# EAGLE schematic io_board (EAGLE 7.7.0)
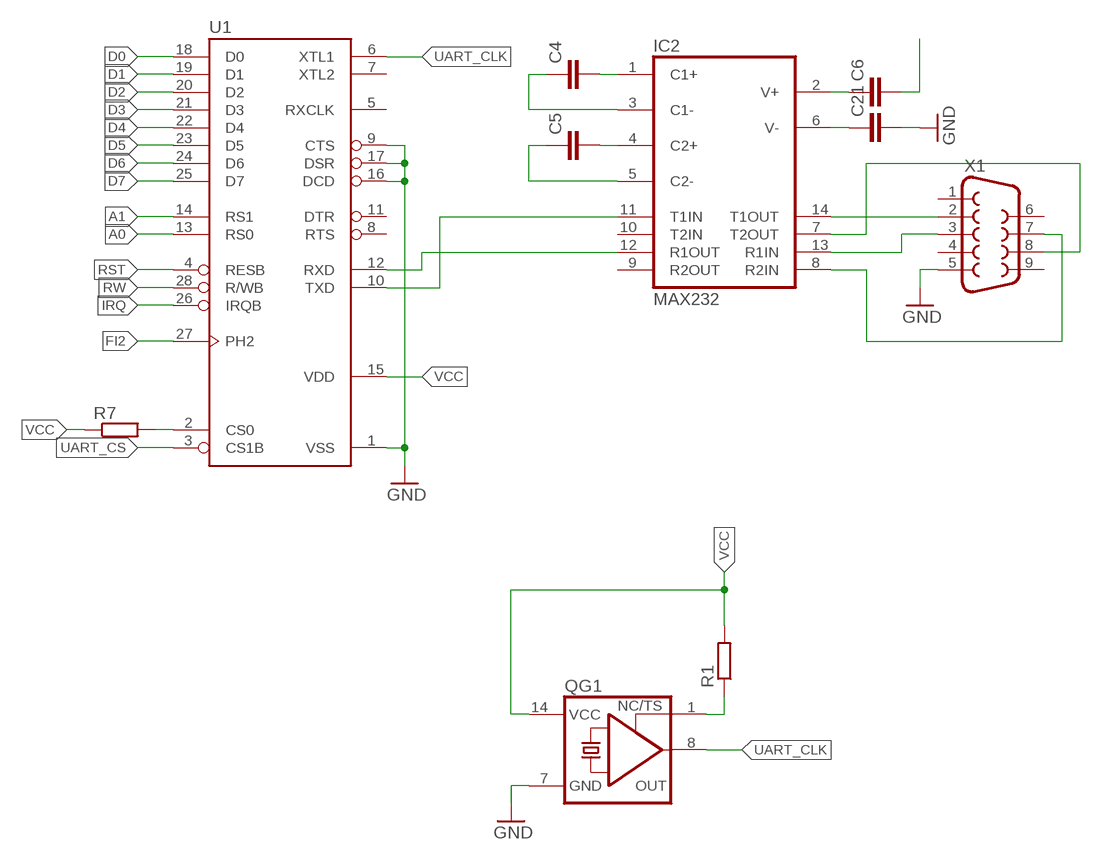
[diagram p0: schematic, sheet 1, part 1 of 2]
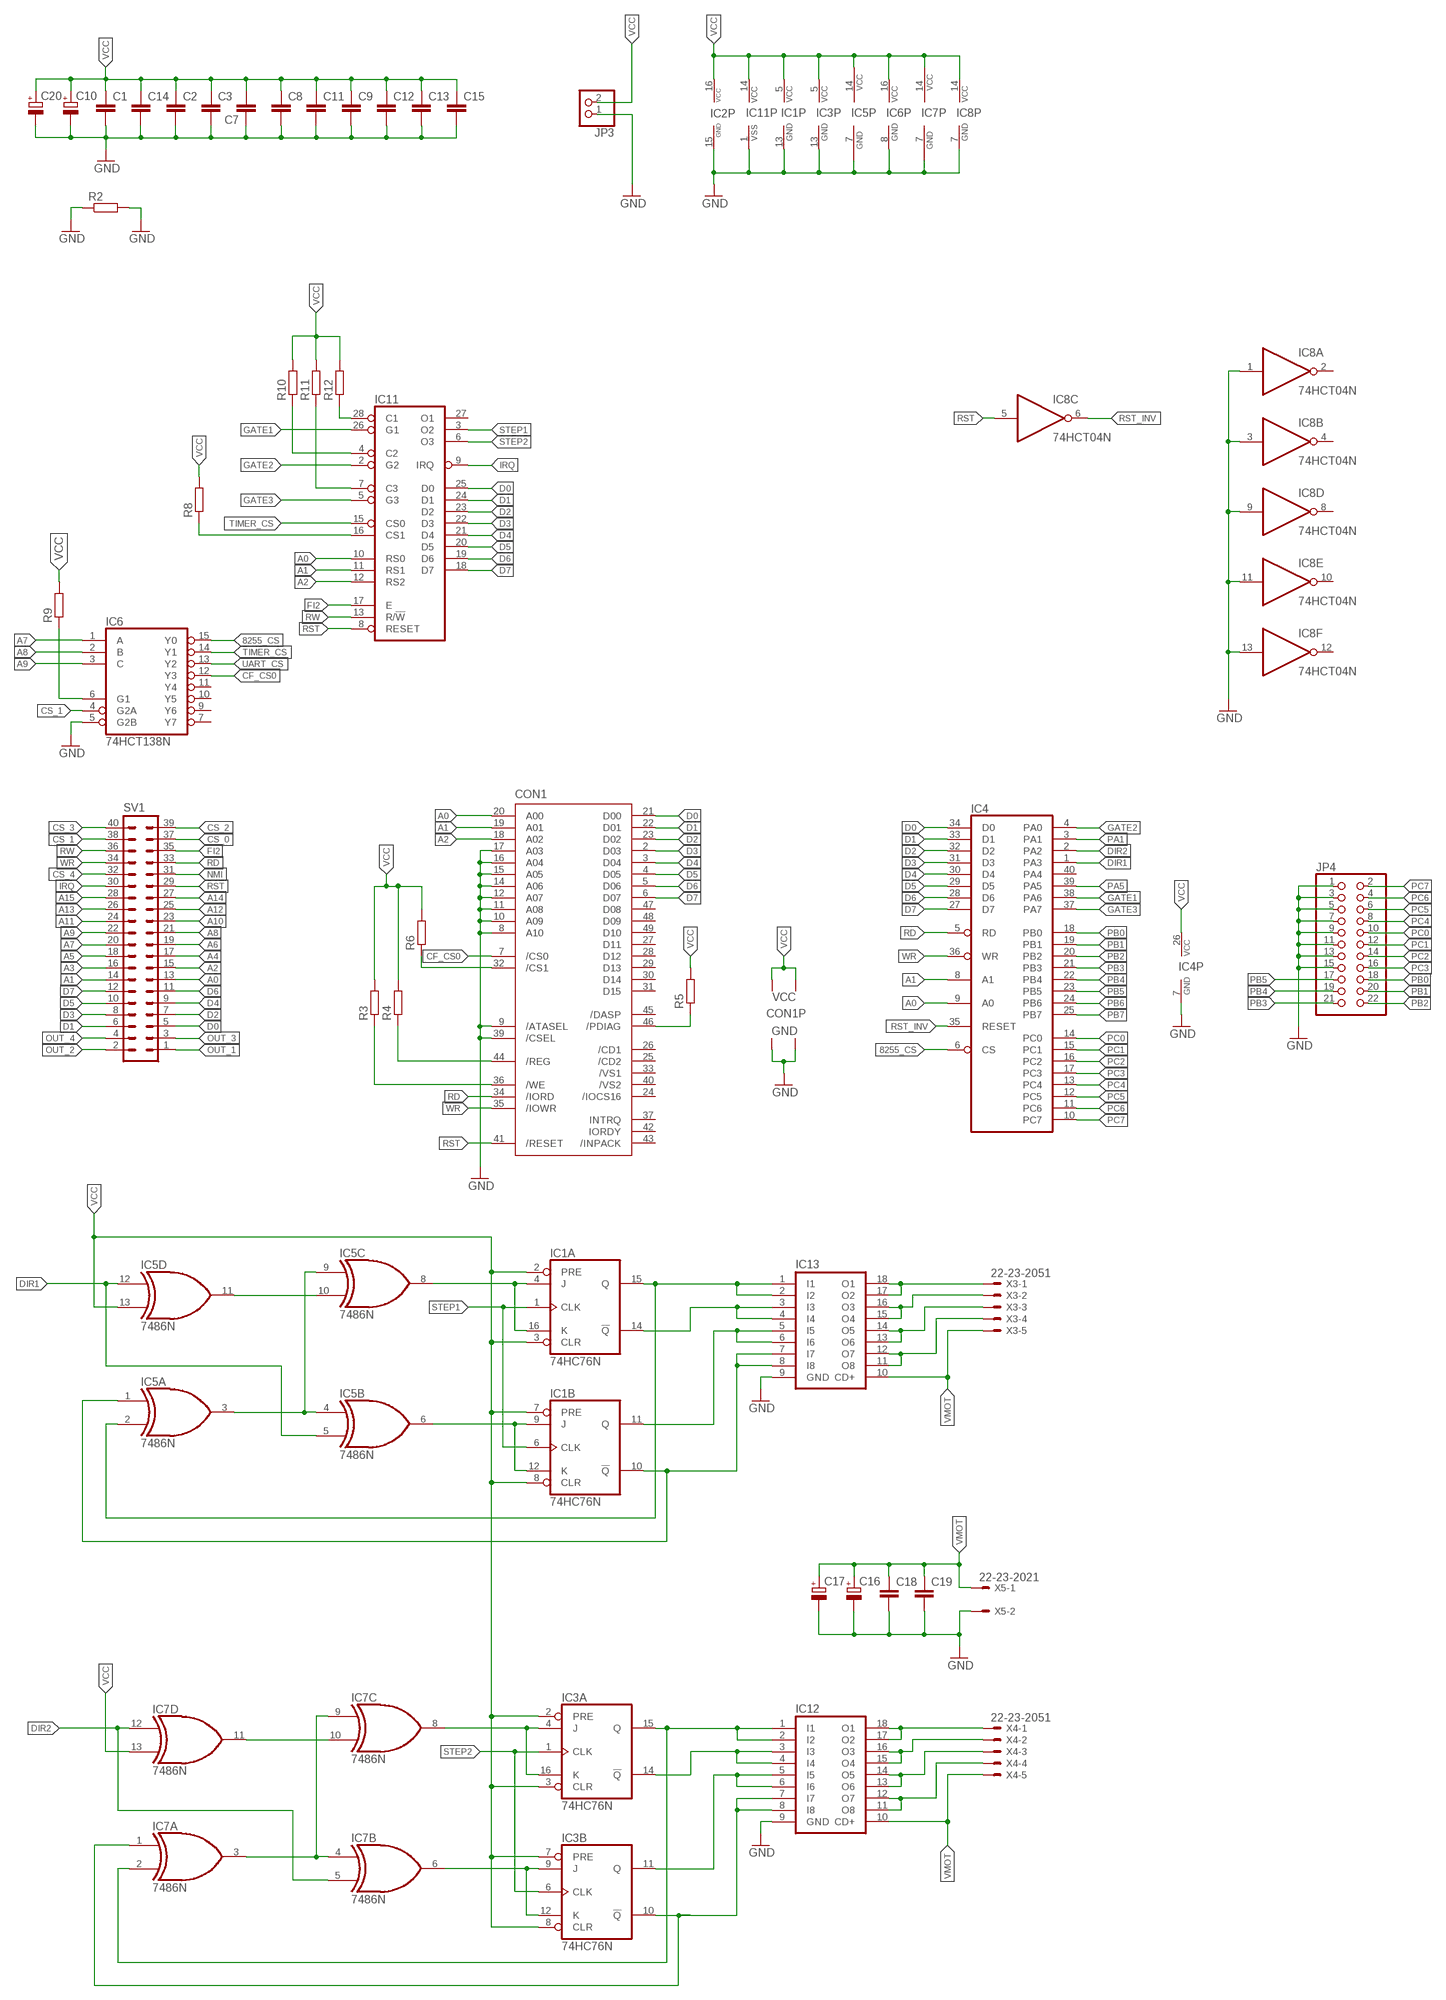
[diagram p1: schematic, sheet 1, part 2 of 2]

## Parts
C1  C-EUC1206  [C1206]
C2  C-EUC1206  [C1206]
C3  C-EUC1206  [C1206]
C4  C-EUC0603  [C0603]
C5  C-EUC0603  [C0603]
C6  C-EUC0603  [C0603]
C7  C-EUC0603  [C0603]
C8  C-EUC0603  [C0603]
C9  C-EUC0603  [C0603]
C10  CPOL-EUE5-10.5  [E5-10,5]
C11  C-EU050-024X044  [C050-024X044]
C12  C-EUC0603  [C0603]
C13  C-EUC0603  [C0603]
C14  C-EUC1206  [C1206]
C15  C-EUC0603  [C0603]
C16  CPOL-EUE5-6  [E5-6]
C17  CPOL-EUE5-6  [E5-6]
C18  C-EUC0603  [C0603]
C19  C-EUC0603  [C0603]
C20  CPOL-EUSMCB  [SMC_B]
C21  C-EUC0603  [C0603]
CON1  CF-CARD-IDE_MODE  [MI20-50PD-SF]
IC1  74HC76N  [DIL16]
IC2  MAX232  [DIL16]
IC3  74HC76N  [DIL16]
IC4  8255A  [DIL40]
IC5  7486N  [DIL14]
IC6  74HCT138N  [DIL16]
IC7  7486N  [DIL14]
IC8  74HCT04N  [DIL14]
IC11  6840  [DIL28]
IC12  ULN2803A  [DIL18]
IC13  ULN2803A  [DIL18]
JP3  PINHD-1X2/90  [1X02/90]
JP4  PINHD-2X11  [2X11]
QG1  XO-14  [DIL14S]
R1  R-EU_R1206  [R1206]
R2  R-EU_M1206  [M1206]
R3  R-EU_R0603  [R0603]
R4  R-EU_R0603  [R0603]
R5  R-EU_R0603  [R0603]
R6  R-EU_R0603  [R0603]
R7  R-EU_R0603  [R0603]
R8  R-EU_R0402  [R0402]
R9  R-EU_R1206  [R1206]
R10  R-EU_R0603  [R0603]
R11  R-EU_0204/7  [0204/7]
R12  R-EU_0204/5  [0204/5]
SV1  ML40L  [ML40L]
U1  G65SC51P  [DIP-28]
X1  F09HP  [F09HP]
X3  22-23-2051  [22-23-2051]
X4  22-23-2051  [22-23-2051]
X5  22-23-2021  [22-23-2021]

## Nets
8255_CS: IC4.6(CS) IC6.15(Y0)
A0: CON1.20(A00) IC4.9(A0) IC11.10(RS0) SV1.13 U1.13(RS0)
A1: CON1.19(A01) IC4.8(A1) IC11.11(RS1) SV1.14 U1.14(RS1)
A2: CON1.18(A02) IC11.12(RS2) SV1.15
A3: SV1.16
A4: SV1.17
A5: SV1.18
A6: SV1.19
A7: IC6.1(A) SV1.20
A8: IC6.2(B) SV1.21
A9: IC6.3(C) SV1.22
A10: SV1.23
A11: SV1.24
A12: SV1.25
A13: SV1.26
A14: SV1.27
A15: SV1.28
CF_CS0: CON1.7(/CS0) IC6.12(Y3)
CS_0: SV1.37
CS_1: IC6.4(G2A) SV1.38
CS_2: SV1.39
CS_3: SV1.40
CS_4: SV1.32
D0: CON1.21(D00) IC4.34(D0) IC11.25(D0) SV1.5 U1.18(D0)
D1: CON1.22(D01) IC4.33(D1) IC11.24(D1) SV1.6 U1.19(D1)
D2: CON1.23(D02) IC4.32(D2) IC11.23(D2) SV1.7 U1.20(D2)
D3: CON1.2(D03) IC4.31(D3) IC11.22(D3) SV1.8 U1.21(D3)
D4: CON1.3(D04) IC4.30(D4) IC11.21(D4) SV1.9 U1.22(D4)
D5: CON1.4(D05) IC4.29(D5) IC11.20(D5) SV1.10 U1.23(D5)
D6: CON1.5(D06) IC4.28(D6) IC11.19(D6) SV1.11 U1.24(D6)
D7: CON1.6(D07) IC4.27(D7) IC11.18(D7) SV1.12 U1.25(D7)
DIR1: IC4.1(PA3) IC5.5(B:I1) IC5.12(D:I0)
DIR2: IC4.2(PA2) IC7.5(B:I1) IC7.12(D:I0)
FI2: IC11.17(E) SV1.35 U1.27(PH2)
GATE1: IC4.38(PA6) IC11.26(G1)
GATE2: IC4.4(PA0) IC11.2(G2)
GATE3: IC4.37(PA7) IC11.5(G3)
GND: C1.2 C2.2 C3.2 C7.1 C8.2 C9.2 C10.- C11.2 C12.2 C13.2 C14.2 C15.2 C16.- C17.- C18.2 C19.2 C20.- C21.2 CON1.1(GND1) CON1.8(A10) CON1.9(/ATASEL) CON1.10(A09) CON1.11(A08) CON1.12(A07) CON1.14(A06) CON1.15(A05) CON1.16(A04) CON1.17(A03) CON1.39(/CSEL) CON1.50(GND2) IC1.13(P:GND) IC2.15(GND) IC3.13(P:GND) IC4.7(GND) IC5.7(P:GND) IC6.5(G2B) IC6.8(GND) IC7.7(P:GND) IC8.1(A:I) IC8.3(B:I) IC8.7(P:GND) IC8.9(D:I) IC8.11(E:I) IC8.13(F:I) IC11.1(VSS) IC12.9(GND) IC13.9(GND) JP3.1 JP4.1 JP4.3 JP4.5 JP4.7 JP4.9 JP4.11 JP4.13 JP4.15 QG1.7(GND) R2.1 R2.2 U1.1(VSS) U1.9(CTS) U1.16(DCD) U1.17(DSR) X1.5 X5.2
IRQ: IC11.9(IRQ) SV1.30 U1.26(IRQB)
MOT1_PHASE1: IC1.15(A:Q) IC5.2(A:I1) IC13.1(I1) IC13.2(I2)
MOT1_PHASE2: IC1.14(A:!Q) IC13.3(I3) IC13.4(I4)
MOT1_PHASE3: IC1.11(B:Q) IC13.5(I5) IC13.6(I6)
MOT1_PHASE4: IC1.10(B:!Q) IC5.1(A:I0) IC13.7(I7) IC13.8(I8)
MOT1_PHASE5: IC3.15(A:Q) IC7.2(A:I1) IC12.1(I1) IC12.2(I2)
MOT1_PHASE6: IC3.14(A:!Q) IC12.3(I3) IC12.4(I4)
MOT1_PHASE7: IC3.11(B:Q) IC12.5(I5) IC12.6(I6)
MOT1_PHASE8: IC3.10(B:!Q) IC7.1(A:I0) IC12.7(I7) IC12.8(I8)
N$5: QG1.1(TS) R1.1
N$6: IC2.13(R1IN) X1.3
N$7: IC2.7(T2OUT) X1.8
N$8: IC2.8(R2IN) X1.7
N$9: C4.2 IC2.1(C1+)
N$10: C5.2 IC2.4(C2+)
N$11: C5.1 IC2.5(C2-)
N$12: C4.1 IC2.3(C1-)
N$13: C6.1 IC2.2(V+)
N$14: C21.1 IC2.6(V-)
N$15: CON1.32(/CS1) R6.1
N$16: IC2.14(T1OUT) X1.2
N$17: R7.2 U1.2(CS0)
N$18: IC6.6(G1) R9.1
N$19: CON1.44(/REG) R4.1
N$20: CON1.36(/WE) R3.1
N$21: CON1.46(/PDIAG) R5.1
N$22: IC1.4(A:J) IC1.16(A:K) IC5.8(C:O)
N$26: IC5.10(C:I1) IC5.11(D:O)
N$27: IC5.3(A:O) IC5.4(B:I0) IC5.9(C:I0)
N$28: IC1.9(B:J) IC1.12(B:K) IC5.6(B:O)
N$29: IC13.17(O2) IC13.18(O1) X3.1
N$30: IC13.15(O4) IC13.16(O3) X3.2
N$31: IC13.13(O6) IC13.14(O5) X3.3
N$32: IC13.11(O8) IC13.12(O7) X3.4
N$33: IC7.10(C:I1) IC7.11(D:O)
N$34: IC7.3(A:O) IC7.4(B:I0) IC7.9(C:I0)
N$35: IC3.4(A:J) IC3.16(A:K) IC7.8(C:O)
N$36: IC3.9(B:J) IC3.12(B:K) IC7.6(B:O)
N$38: IC12.17(O2) IC12.18(O1) X4.1
N$39: IC12.15(O4) IC12.16(O3) X4.2
N$40: IC12.13(O6) IC12.14(O5) X4.3
N$41: IC12.11(O8) IC12.12(O7) X4.4
N$42: IC11.16(CS1) R8.1
N$252: IC11.4(C2) R10.1
N$253: IC11.7(C3) R11.1
N$255: IC11.28(C1) R12.1
NMI: SV1.31
OUT_1: SV1.1
OUT_2: SV1.2
OUT_3: SV1.3
OUT_4: SV1.4
PA1: IC4.3(PA1)
PA5: IC4.39(PA5)
PB0: IC4.18(PB0) JP4.18
PB1: IC4.19(PB1) JP4.20
PB2: IC4.20(PB2) JP4.22
PB3: IC4.21(PB3) JP4.21
PB4: IC4.22(PB4) JP4.19
PB5: IC4.23(PB5) JP4.17
PB6: IC4.24(PB6)
PB7: IC4.25(PB7)
PC0: IC4.14(PC0) JP4.10
PC1: IC4.15(PC1) JP4.12
PC2: IC4.16(PC2) JP4.14
PC3: IC4.17(PC3) JP4.16
PC4: IC4.13(PC4) JP4.8
PC5: IC4.12(PC5) JP4.6
PC6: IC4.11(PC6) JP4.4
PC7: IC4.10(PC7) JP4.2
RD: CON1.34(/IORD) IC4.5(RD) SV1.33
RST: CON1.41(/RESET) IC8.5(C:I) IC11.8(RESET) SV1.29 U1.4(RESB)
RST_INV: IC4.35(RESET) IC8.6(C:O)
RW: IC11.13(R/!W) SV1.36 U1.28(R/WB)
RXD_TTL: IC2.12(R1OUT) U1.12(RXD)
STEP1: IC1.1(A:CLK) IC1.6(B:CLK) IC11.3(O2)
STEP2: IC3.1(A:CLK) IC3.6(B:CLK) IC11.6(O3)
TIMER_CS: IC6.14(Y1) IC11.15(CS0)
TXD_TTL: IC2.11(T1IN) U1.10(TXD)
UART_CLK: QG1.8(OUT) U1.6(XTL1)
UART_CS: IC6.13(Y2) U1.3(CS1B)
VCC: C1.1 C2.1 C3.1 C6.2 C7.2 C8.1 C9.1 C10.+ C11.1 C12.1 C13.1 C14.1 C15.1 C20.+ CON1.13(VCC2) CON1.38(VCC1) IC1.2(A:PRE) IC1.3(A:CLR) IC1.5(P:VCC) IC1.7(B:PRE) IC1.8(B:CLR) IC2.16(VCC) IC3.2(A:PRE) IC3.3(A:CLR) IC3.5(P:VCC) IC3.7(B:PRE) IC3.8(B:CLR) IC4.26(VCC) IC5.13(D:I1) IC5.14(P:VCC) IC6.16(VCC) IC7.13(D:I1) IC7.14(P:VCC) IC8.14(P:VCC) IC11.14(VCC) JP3.2 QG1.14(VCC) R1.2 R3.2 R4.2 R5.2 R6.2 R7.1 R8.2 R9.2 R10.2 R11.2 R12.2 U1.15(VDD)
VMOT: C16.+ C17.+ C18.1 C19.1 IC12.10(CD+) IC13.10(CD+) X3.5 X4.5 X5.1
WR: CON1.35(/IOWR) IC4.36(WR) SV1.34
Unconnected: CON1.24(/IOCS16) CON1.25(/CD2) CON1.26(/CD1) CON1.27(D11) CON1.28(D12) CON1.29(D13) CON1.30(D14) CON1.31(D15) CON1.33(/VS1) CON1.37(INTRQ) CON1.40(/VS2) CON1.42(IORDY) CON1.43(/INPACK) CON1.45(/DASP) CON1.47(D08) CON1.48(D09) CON1.49(D10) IC2.9(R2OUT) IC2.10(T2IN) IC4.40(PA4) IC6.7(Y7) IC6.9(Y6) IC6.10(Y5) IC6.11(Y4) IC8.2(A:O) IC8.4(B:O) IC8.8(D:O) IC8.10(E:O) IC8.12(F:O) IC11.27(O1) U1.5(RXCLK) U1.7(XTL2) U1.8(RTS) U1.11(DTR) X1.1 X1.4 X1.6 X1.9

## Library data of the parts
C1-C9 C11-C15 C18 C19 C21 = rcl:C-EU: CAPACITOR, European symbol
C10 C16 C17 C20 = rcl:CPOL-EU: POLARIZED CAPACITOR, European symbol
CON1 = con-hirose:CF-CARD-IDE_MODE: Compact Flash Adapter Type I or II without Eject Button Source: con-hirose.lbr from Bob Starr <rtzaudio@mindspring.com>; OC_FARNELL: unknown; OC_NEWARK: unknown
IC1 IC3 = 74xx-eu:74*76: Dual J-K FLIP FLOP, preset and clear
IC2 = maxim:MAX232: RS232 TRANSCEIVER; MF: MAXIM; MPN: MAX232ACPE+; OC_FARNELL: 9723773; OC_NEWARK: 68K4544
IC4 = micro-intel:8255A: MICROCOMPUTER/PERIPHERAL DEVICE; OC_FARNELL: unknown; OC_NEWARK: unknown
IC5 IC7 = 74xx-us:74*86: Quad 2-input EXCLUSIV-OR (XOR) gate
IC6 = 74xx-eu:74*138: 3-line to 8-line DECODER/DEMULTIPLEXER
IC8 = 74xx-eu:74*04: Hex INVERTER
IC11 = micro-motorola:6840: MICROCONTROLLER/MEMORY DEVICE; OC_FARNELL: unknown; OC_NEWARK: unknown
IC12 IC13 = uln-udn:ULN2803A: DRIVER ARRAY
JP3 = pinhead:PINHD-1X2: PIN HEADER
JP4 = pinhead:PINHD-2X11: PIN HEADER
QG1 = crystal:XO-: CRYSTAL; OC_FARNELL: unknown; OC_NEWARK: unknown
R1-R12 = rcl:R-EU_: RESISTOR, European symbol
SV1 = con-harting-ml:ML40: HARTING; OC_FARNELL: unknown; OC_NEWARK: unknown
U1 = 65xxx:G65SC51P: California Micro Devices Version
X1 = con-subd:F09: SUB-D; OC_FARNELL: unknown; OC_NEWARK: unknown
X3 X4 = con-molex:22-23-2051: .100" (2.54mm) Center Header - 5 Pin; MF: MOLEX; MPN: 22-23-2051; OC_FARNELL: 1462952; OC_NEWARK: 38C9178
X5 = con-molex:22-23-2021: .100" (2.54mm) Center Header - 2 Pin; MF: MOLEX; MPN: 22-23-2021; OC_FARNELL: 1462926; OC_NEWARK: 25C3832